# Altium project visor_cots.PrjPcb
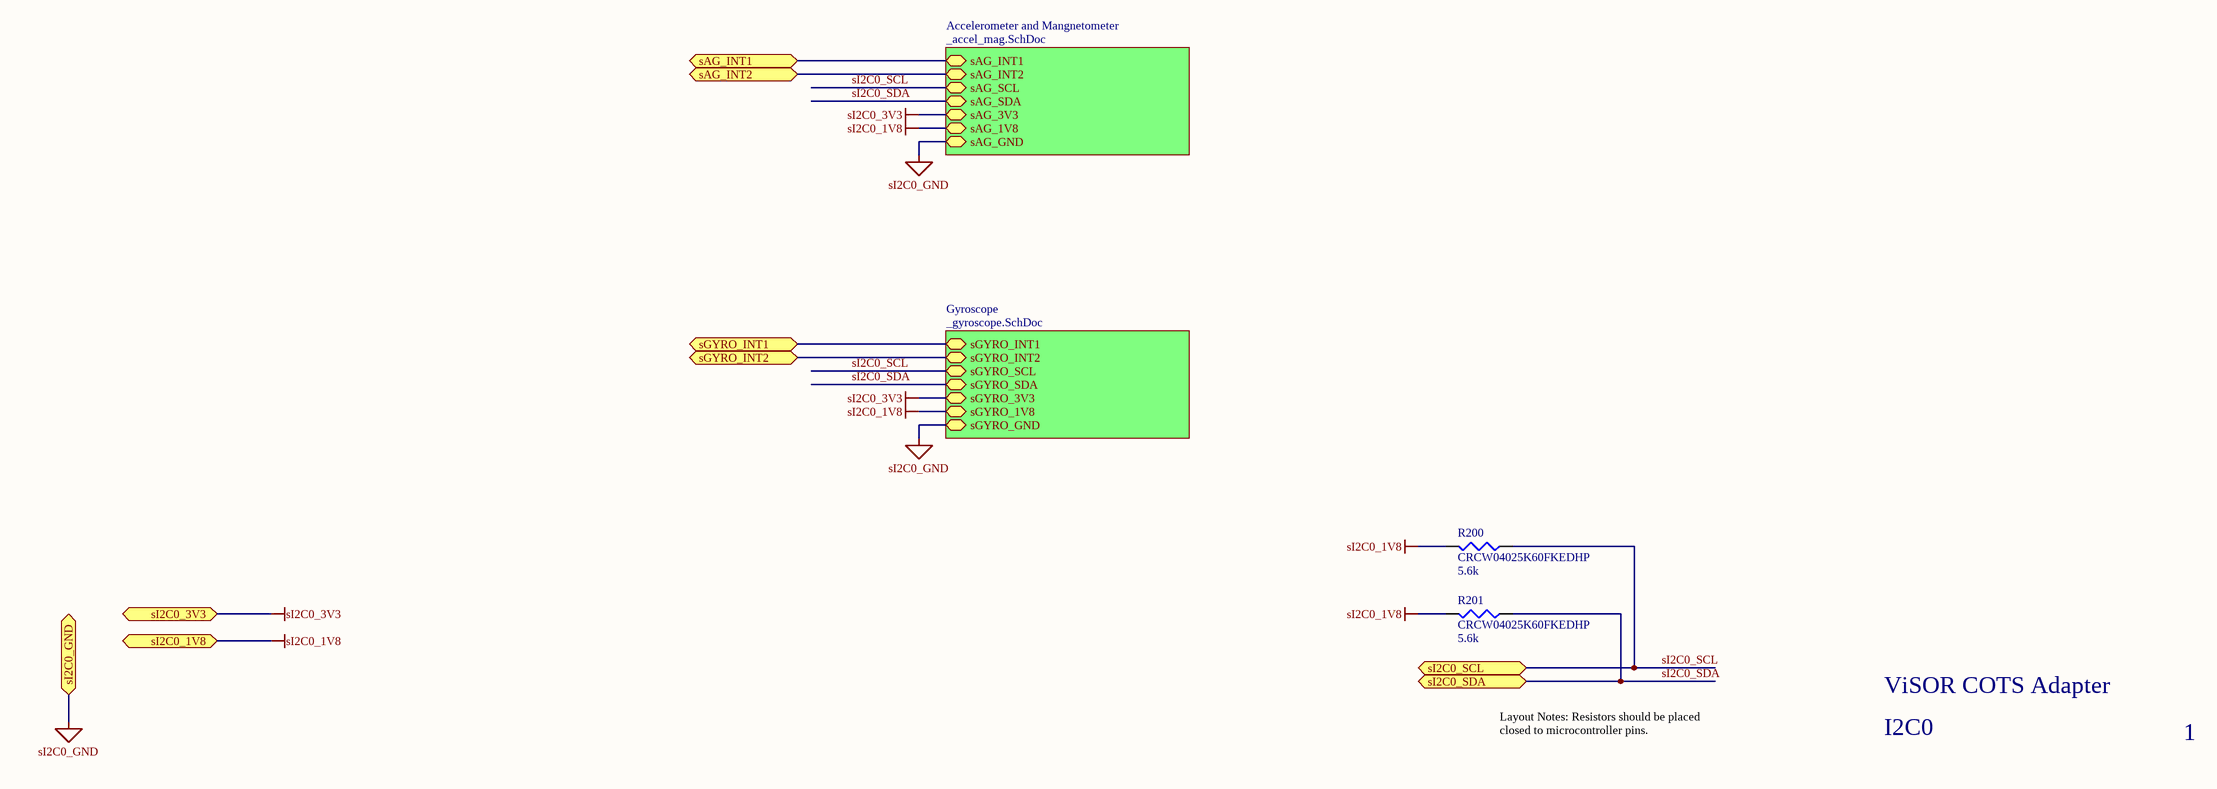
[diagram p0: _i2c0.SchDoc]
6 sheets, 116 parts. Net scope: strictly hierarchical (ports join the sheet entries above them; power ports are local).
Board file: 7798-20-0228.PcbDoc
Sheets:
  _i2c0.SchDoc
    Accelerometer and Mangnetometer = _accel_mag.SchDoc
    Gyroscope = _gyroscope.SchDoc
  TOP.SchDoc
    Dragonboard Connections = _power.SchDoc
    Dragonboard Connections = _io.SchDoc
    Accelerometer & Magnetometer = _accel_mag.SchDoc
    Gyroscope = _gyroscope.SchDoc

## Sheet _i2c0.SchDoc
size Tabloid

### Parts
R200  CRCW04025K60FKEDHP  value 5.6k  [0402]
R201  CRCW04025K60FKEDHP  value 5.6k  [0402]

### Sub-sheets
Accelerometer and Mangnetometer = _accel_mag.SchDoc: sAG_3V3, sAG_GND, sAG_SCL, sAG_SDA, sAG_INT1, sAG_INT2, sAG_1V8
Gyroscope = _gyroscope.SchDoc: sGYRO_3V3, sGYRO_GND, sGYRO_INT1, sGYRO_INT2, sGYRO_SCL, sGYRO_SDA, sGYRO_1V8

### Ports
sAG_INT1, sAG_INT2, sGYRO_INT1, sGYRO_INT2, sI2C0_1V8, sI2C0_3V3, sI2C0_GND, sI2C0_SCL, sI2C0_SDA

### Nets
sI2C0_1V8: R200.2 R201.2 ; port sI2C0_1V8, sheet Accelerometer and Mangnetometer/sAG_1V8, sheet Gyroscope/sGYRO_1V8  [project net sAG_1V8]
sI2C0_3V3: port sI2C0_3V3, sheet Accelerometer and Mangnetometer/sAG_3V3, sheet Gyroscope/sGYRO_3V3  [project net sAG_3V3]
sI2C0_GND: port sI2C0_GND, sheet Accelerometer and Mangnetometer/sAG_GND, sheet Gyroscope/sGYRO_GND  [project net sAG_GND]
sI2C0_SCL: R200.1 ; port sI2C0_SCL, sheet Accelerometer and Mangnetometer/sAG_SCL, sheet Gyroscope/sGYRO_SCL
sI2C0_SDA: R201.1 ; port sI2C0_SDA, sheet Accelerometer and Mangnetometer/sAG_SDA, sheet Gyroscope/sGYRO_SDA
NetR300_Accelerometer_and_Mangnetometer_2: port sAG_INT2, sheet Accelerometer and Mangnetometer/sAG_INT2
NetR301_Accelerometer_and_Mangnetometer_2: port sAG_INT1, sheet Accelerometer and Mangnetometer/sAG_INT1
NetU350_Gyroscope_2: port sGYRO_INT2, sheet Gyroscope/sGYRO_INT2
NetU350_Gyroscope_3: port sGYRO_INT1, sheet Gyroscope/sGYRO_INT1

### Notes on the sheet
- ViSOR COTS Adapter
- Layout Notes: Resistors should be placed closed to microcontroller pins.
- I2C0
- 1

### Library data of the parts
R200 R201 = CRCW0402xxxxFKED: 0.125W, -55-155C, 1005, 50V, ±1%

## Sheet _accel_mag.SchDoc
size Tabloid
Used 2 times, as channels Accelerometer and Mangnetometer, Accelerometer & Magnetometer. Parts and nets are listed once, with the designators drawn on the sheet.
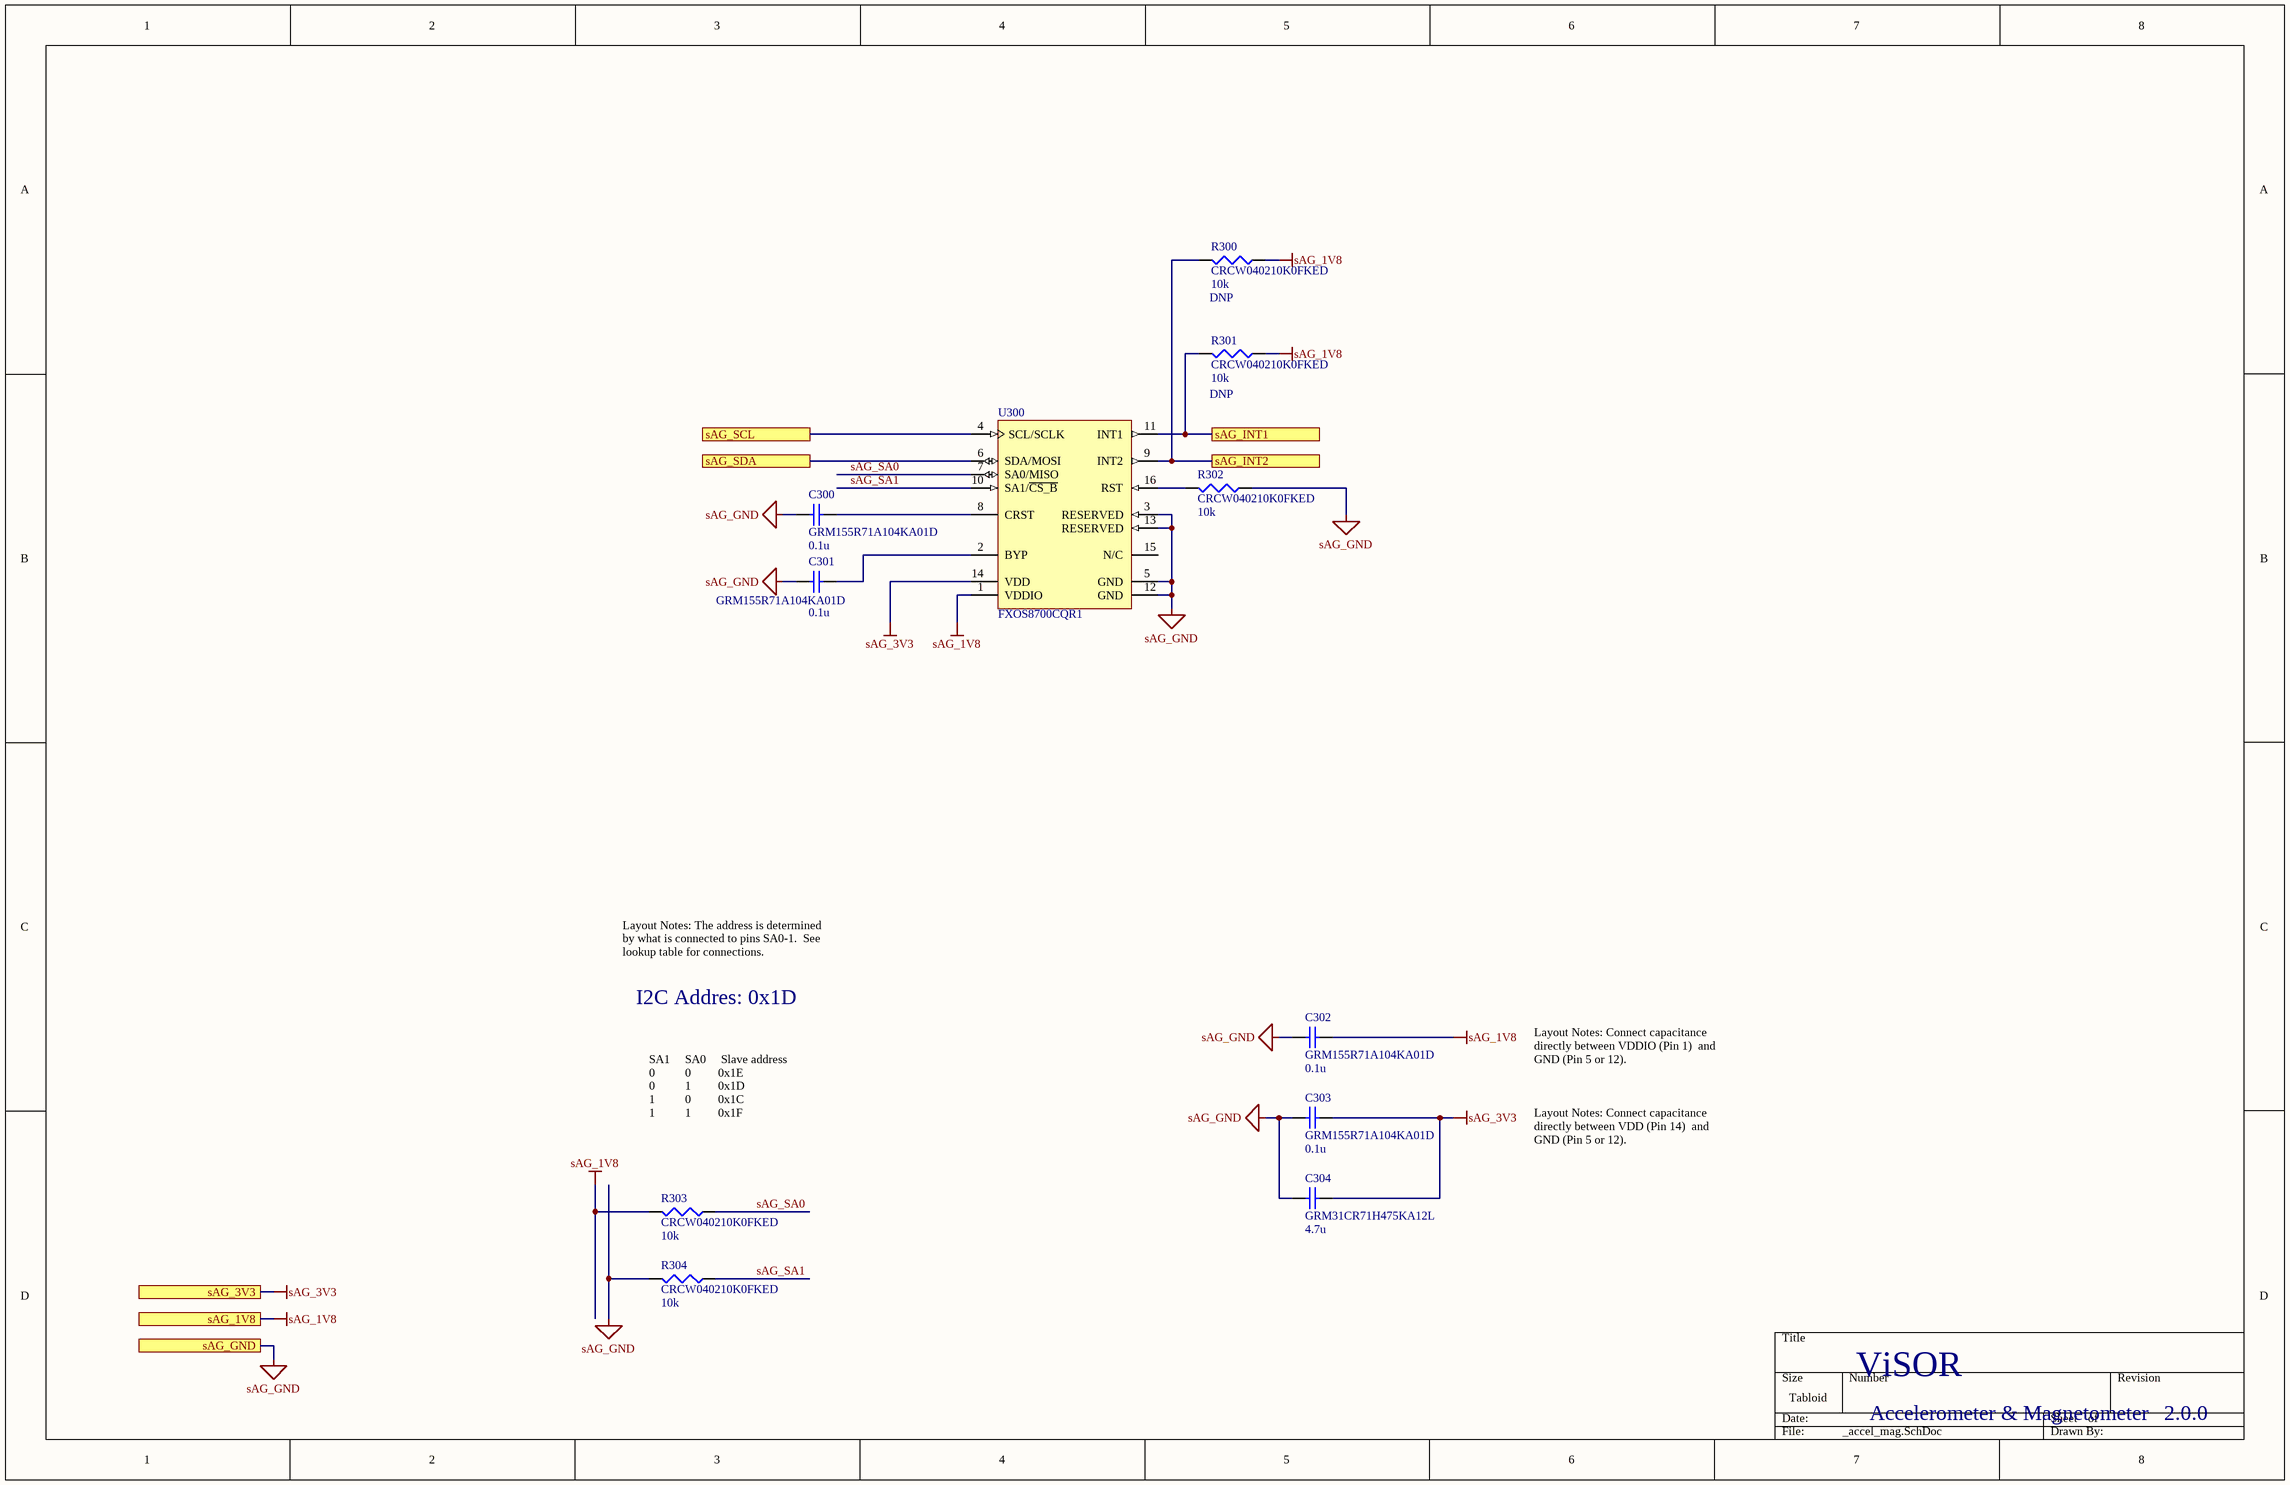
[diagram p1: _accel_mag.SchDoc]

### Parts
C300  GRM155R71A104KA01D  value 0.1u  [0402]
C301  GRM155R71A104KA01D  value 0.1u  [0402]
C302  GRM155R71A104KA01D  value 0.1u  [0402]
C303  GRM155R71A104KA01D  value 0.1u  [0402]
C304  GRM31CR71H475KA12L  value 4.7u  [1206]
R300  CRCW040210K0FKED  value 10k  [0402]
R301  CRCW040210K0FKED  value 10k  [0402]
R302  CRCW040210K0FKED  value 10k  [0402]
R303  CRCW040210K0FKED  value 10k  [0402]
R304  CRCW040210K0FKED  value 10k  [0402]
U300  FXOS8700CQR1  [FREE-QFN-16-3000X3000DE_V]

### Ports
sAG_1V8, sAG_3V3, sAG_GND, sAG_INT1, sAG_INT2, sAG_SCL, sAG_SDA

### Nets
sAG_1V8: C302.2 R300.1 R301.1 R303.2 U300.1(VDDIO) ; port sAG_1V8
sAG_3V3: C303.2 C304.2 U300.14(VDD) ; port sAG_3V3
sAG_GND: C300.2 C301.2 C302.1 C303.1 C304.1 R302.1 R304.2 U300.3(RESERVED) U300.5(GND) U300.12(GND) U300.13(RESERVED) ; port sAG_GND
sAG_INT1: R301.2 U300.11(INT1) ; port sAG_INT1
sAG_INT2: R300.2 U300.9(INT2) ; port sAG_INT2
sAG_SA0: R303.1 U300.7(SA0/MISO)
sAG_SA1: R304.1 U300.10(SA1/~{CS_B})
sAG_SCL: U300.4(SCL/SCLK) ; port sAG_SCL
sAG_SDA: U300.6(SDA/MOSI) ; port sAG_SDA
NetC300_1: C300.1 U300.8(CRST)
NetC301_1: C301.1 U300.2(BYP)
NetR302_2: R302.2 U300.16(RST)

Not connected (* = marked no-connect by the designer): U300 15(N/C)

### Channels
Accelerometer and Mangnetometer: designators end in _Accelerometer_and_Mangnetometer; ports sAG_1V8=sAG_1V8 sAG_3V3=sAG_3V3 sAG_GND=sAG_GND sAG_INT1=NetR301_Accelerometer_and_Mangnetometer_2 sAG_INT2=NetR300_Accelerometer_and_Mangnetometer_2 sAG_SCL=sI2C0_SCL sAG_SDA=sI2C0_SDA
Accelerometer & Magnetometer: ports sAG_1V8=sAG_1V8 sAG_3V3=sAG_3V3 sAG_GND=sAG_GND sAG_INT1=sGPIO_19/sAG_INT1 sAG_INT2=sGPIO_17/sAG_INT2 sAG_SCL=sI2C0_SCL sAG_SDA=sI2C0_SDA

### Notes on the sheet
- Layout Notes: The address is determined by what is connected to pins SA0-1.  See lookup table for connections.
- I2C Addres: 0x1D
- Layout Notes: Connect capacitance directly between VDDIO (Pin 1)  and GND (Pin 5 or 12).
- SA1     SA0     Slave address
  0          0         0x1E
  0          1         0x1D
  1          0         0x1C
  1          1         0x1F
- Layout Notes: Connect capacitance directly between VDD (Pin 14)  and GND (Pin 5 or 12).
- ViSOR
- Accelerometer & Magnetometer
- 2.0.0
- (in symbol CRCW0402xxxxFKED) DNP

### Library data of the parts
C300-C303 = GRM155R71AxxxKdddd: -55-125C, 1005, 10V, X7R, ±10%
C304 = GRM31CR71HxxxKdddd: -55-125C, 3216, 50V, X7R, ±10%
R300-R304 = CRCW0402xxxxFKED: 0.125W, -55-155C, 1005, 50V, ±1%
U300 = CMP-2000-05129-1: 6-Axis Xtrinsic Sensor with Integrated Linear Accelerometer and Magnetometer, 1.95 to 3.6 V, -40 to 85 degC, 16-Pin QFN, RoHS, Tape and Reel; Manufacturer: Freescale; Supply Voltage - Min: 1.95V; Operating Supply Voltage: 1.95Vto3.6V; Unit Weight: 0.000808oz; Supply Voltage - Max: 3.6V; Brand: FreescaleSemiconductor; Sensing Axis: X,Y,Z; Output Type: Digital; Package / Case: QFN-16; Datasheet Version: Rev. 1, 06/2012; Factory Pack Quantity: 1000; Mounting Style: SMD/SMT; Datasheet URL: https://datasheet.ciiva.com/12175/fxos8700cq-60595-12175213.pdf; Type: 6AxisSensor; Maximum Operating Temperature: +85C; Manufacturer URL: http://www.nxp.com/; Package Description: 16-Pin Quad Flat No-lead Package, Body 3 x 3 mm, Pitch 0.5 mm; RoHS: Details; Package Reference: QFN-16; Tradename: Xtrinsic; Packaging: Reel; Minimum Operating Temperature: -40C; Product Category: BoardMountAccelerationSensors

## Sheet _gyroscope.SchDoc
size Tabloid
Used 2 times, as channels Gyroscope, Gyroscope. Parts and nets are listed once, with the designators drawn on the sheet.
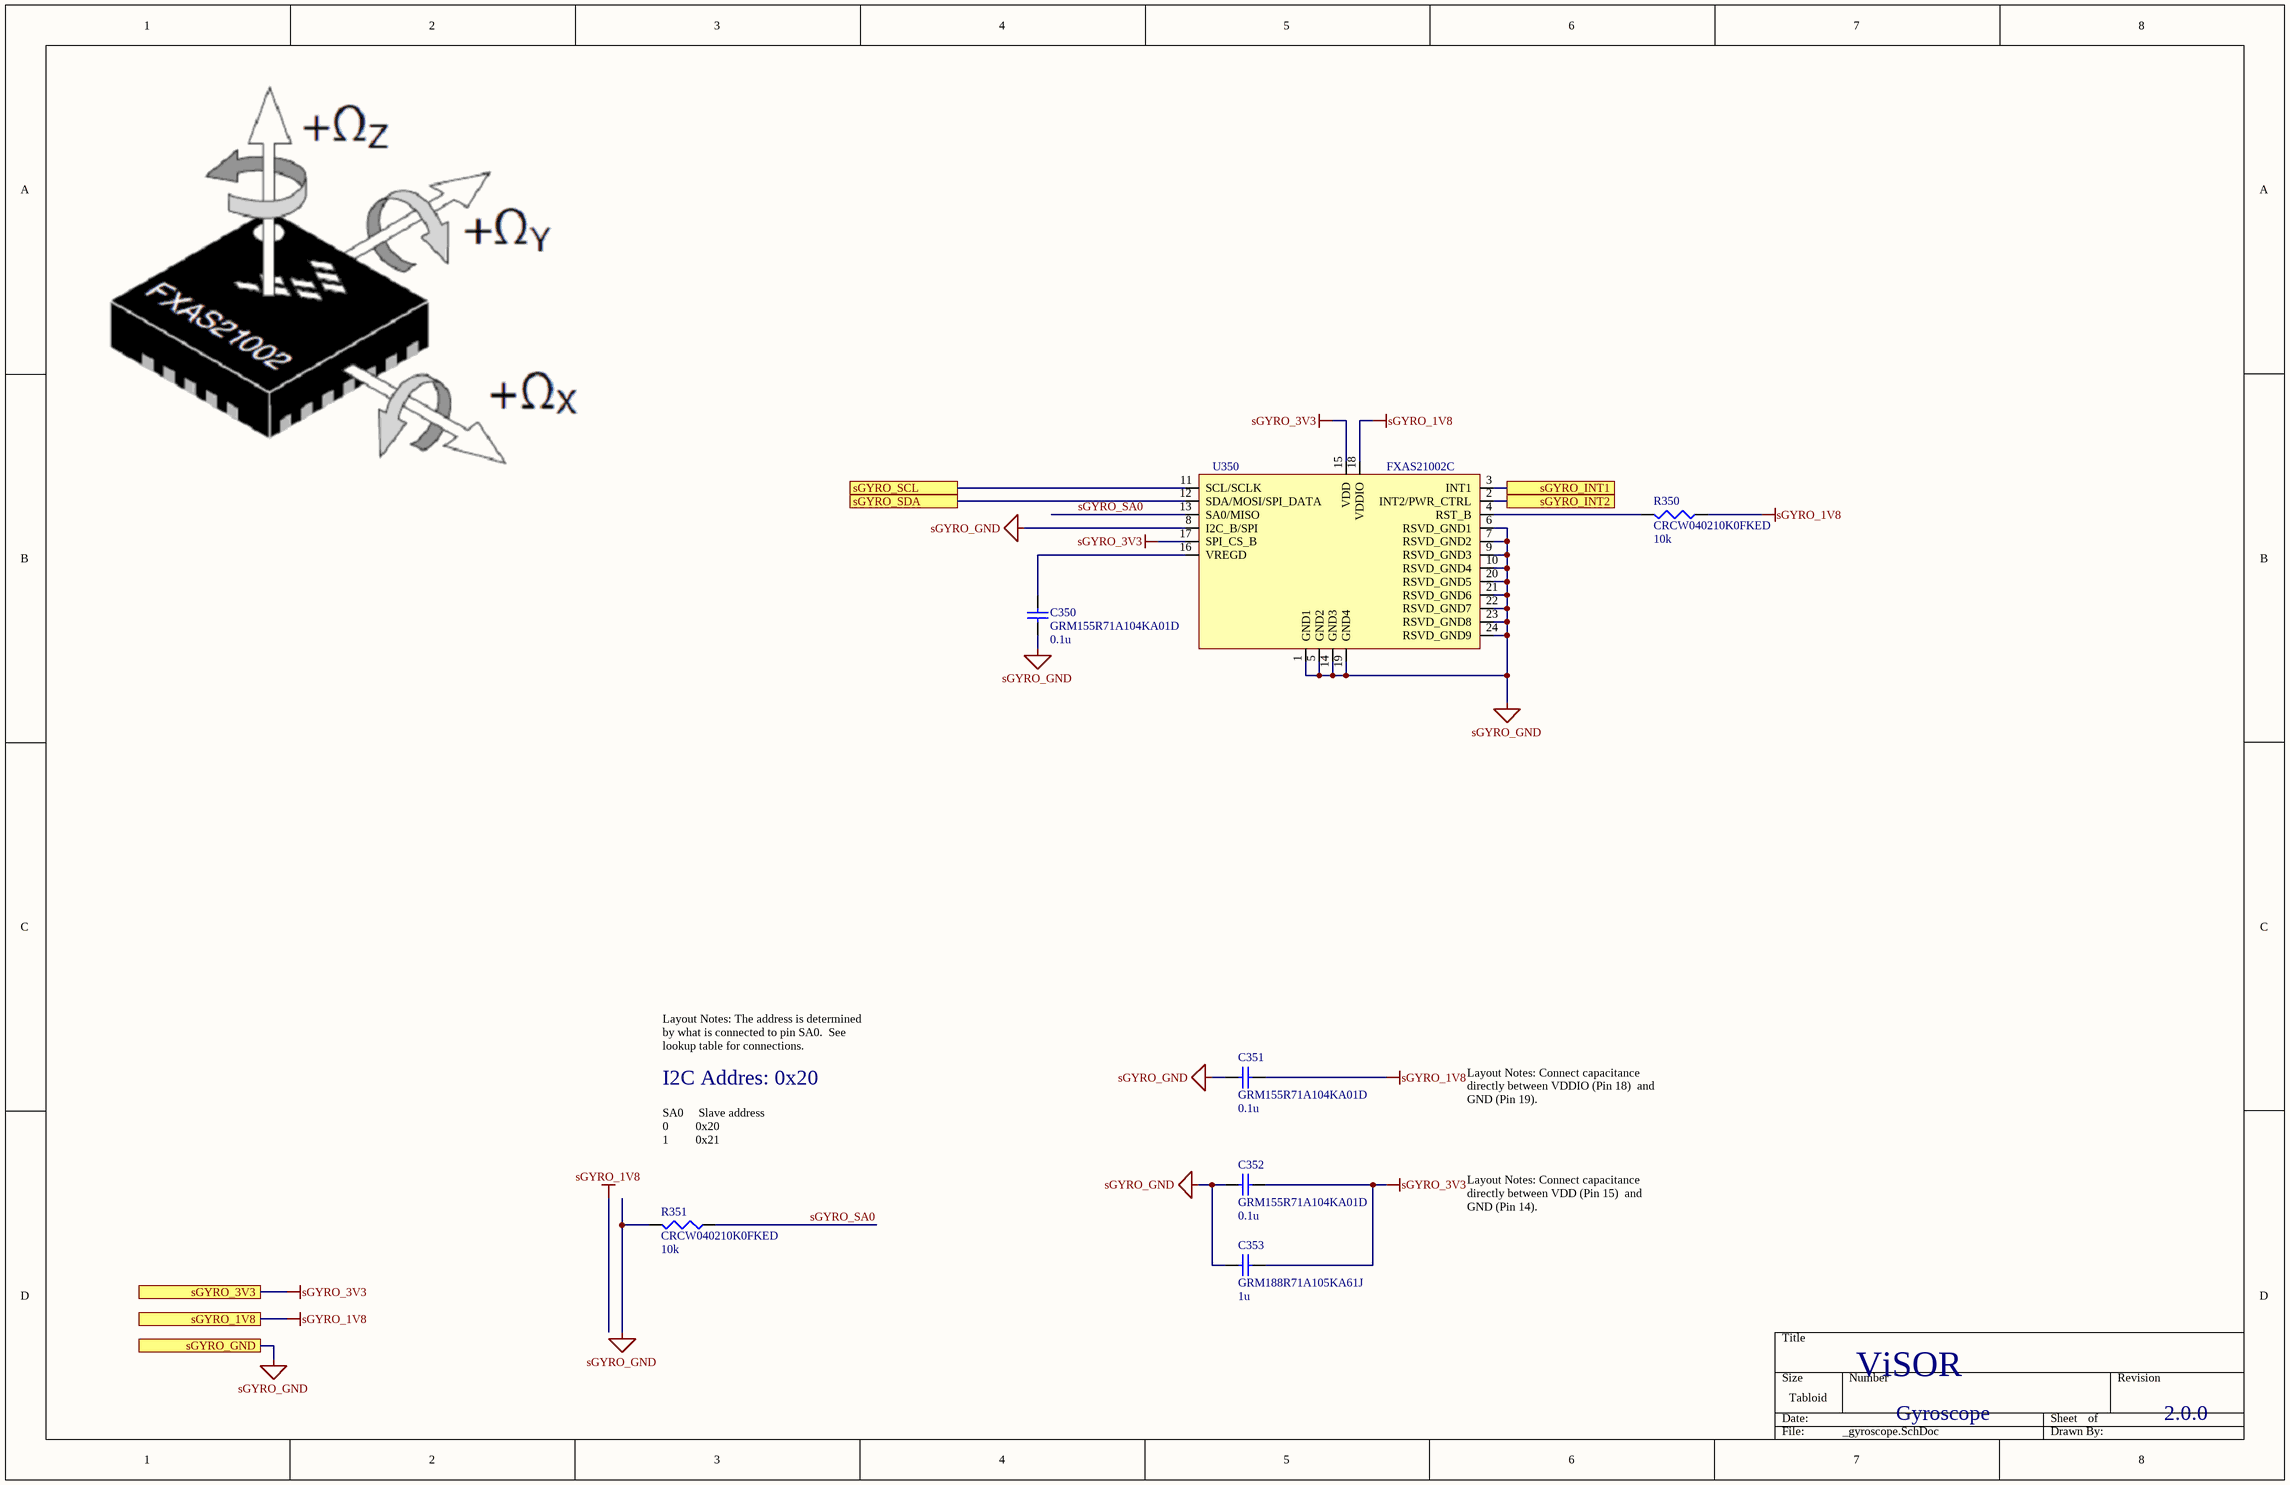
[diagram p2: _gyroscope.SchDoc]

### Parts
C350  GRM155R71A104KA01D  value 0.1u  [0402]
C351  GRM155R71A104KA01D  value 0.1u  [0402]
C352  GRM155R71A104KA01D  value 0.1u  [0402]
C353  GRM188R71A105KA61J  value 1u  [0603]
R350  CRCW040210K0FKED  value 10k  [0402]
R351  CRCW040210K0FKED  value 10k  [0402]
U350  FXAS21002C  [SMD QFN 24_4X4MM 7/5]

### Ports
sGYRO_1V8, sGYRO_3V3, sGYRO_GND, sGYRO_INT1, sGYRO_INT2, sGYRO_SCL, sGYRO_SDA

### Nets
sGYRO_1V8: C351.2 R350.1 U350.18(VDDIO) ; port sGYRO_1V8
sGYRO_3V3: C352.2 C353.1 U350.15(VDD) U350.17(SPI_CS_B) ; port sGYRO_3V3
sGYRO_GND: C350.2 C351.1 C352.1 C353.2 R351.2 U350.1(GND1) U350.5(GND2) U350.6(RSVD_GND1) U350.7(RSVD_GND2) U350.8(I2C_B/SPI) U350.9(RSVD_GND3) U350.10(RSVD_GND4) U350.14(GND3) U350.19(GND4) U350.20(RSVD_GND5) U350.21(RSVD_GND6) U350.22(RSVD_GND7) U350.23(RSVD_GND8) U350.24(RSVD_GND9) ; port sGYRO_GND
sGYRO_INT1: U350.3(INT1) ; port sGYRO_INT1
sGYRO_INT2: U350.2(INT2/PWR_CTRL) ; port sGYRO_INT2
sGYRO_SA0: R351.1 U350.13(SA0/MISO)
sGYRO_SCL: U350.11(SCL/SCLK) ; port sGYRO_SCL
sGYRO_SDA: U350.12(SDA/MOSI/SPI_DATA) ; port sGYRO_SDA
NetC350_1: C350.1 U350.16(VREGD)
NetR350_2: R350.2 U350.4(RST_B)

### Channels
Gyroscope: designators end in _Gyroscope; ports sGYRO_1V8=sAG_1V8 sGYRO_3V3=sAG_3V3 sGYRO_GND=sAG_GND sGYRO_INT1=NetU350_Gyroscope_3 sGYRO_INT2=NetU350_Gyroscope_2 sGYRO_SCL=sI2C0_SCL sGYRO_SDA=sI2C0_SDA
Gyroscope: ports sGYRO_1V8=sAG_1V8 sGYRO_3V3=sAG_3V3 sGYRO_GND=sAG_GND sGYRO_INT1=sGPIO_18/sGYRO_INT1 sGYRO_INT2=sGPIO_16/sGYRO_INT2 sGYRO_SCL=sI2C0_SCL sGYRO_SDA=sI2C0_SDA

### Notes on the sheet
- I2C Addres: 0x20
- Layout Notes: The address is determined by what is connected to pin SA0.  See lookup table for connections.
- Layout Notes: Connect capacitance directly between VDDIO (Pin 18)  and GND (Pin 19).
- SA0     Slave address
  0         0x20
  1         0x21
- Layout Notes: Connect capacitance directly between VDD (Pin 15)  and GND (Pin 14).
- ViSOR
- Gyroscope
- 2.0.0

### Library data of the parts
C350-C352 = GRM155R71AxxxKdddd: -55-125C, 1005, 10V, X7R, ±10%
C353 = GRM188R71AxxxKdddd: -55-125C, 1608, 10V, X7R, ±10%
R350 R351 = CRCW0402xxxxFKED: 0.125W, -55-155C, 1005, 50V, ±1%
U350 = FXAS21002C: 3-Axis Digital Angular Rate  Gyroscope

## Sheet TOP.SchDoc
size Tabloid
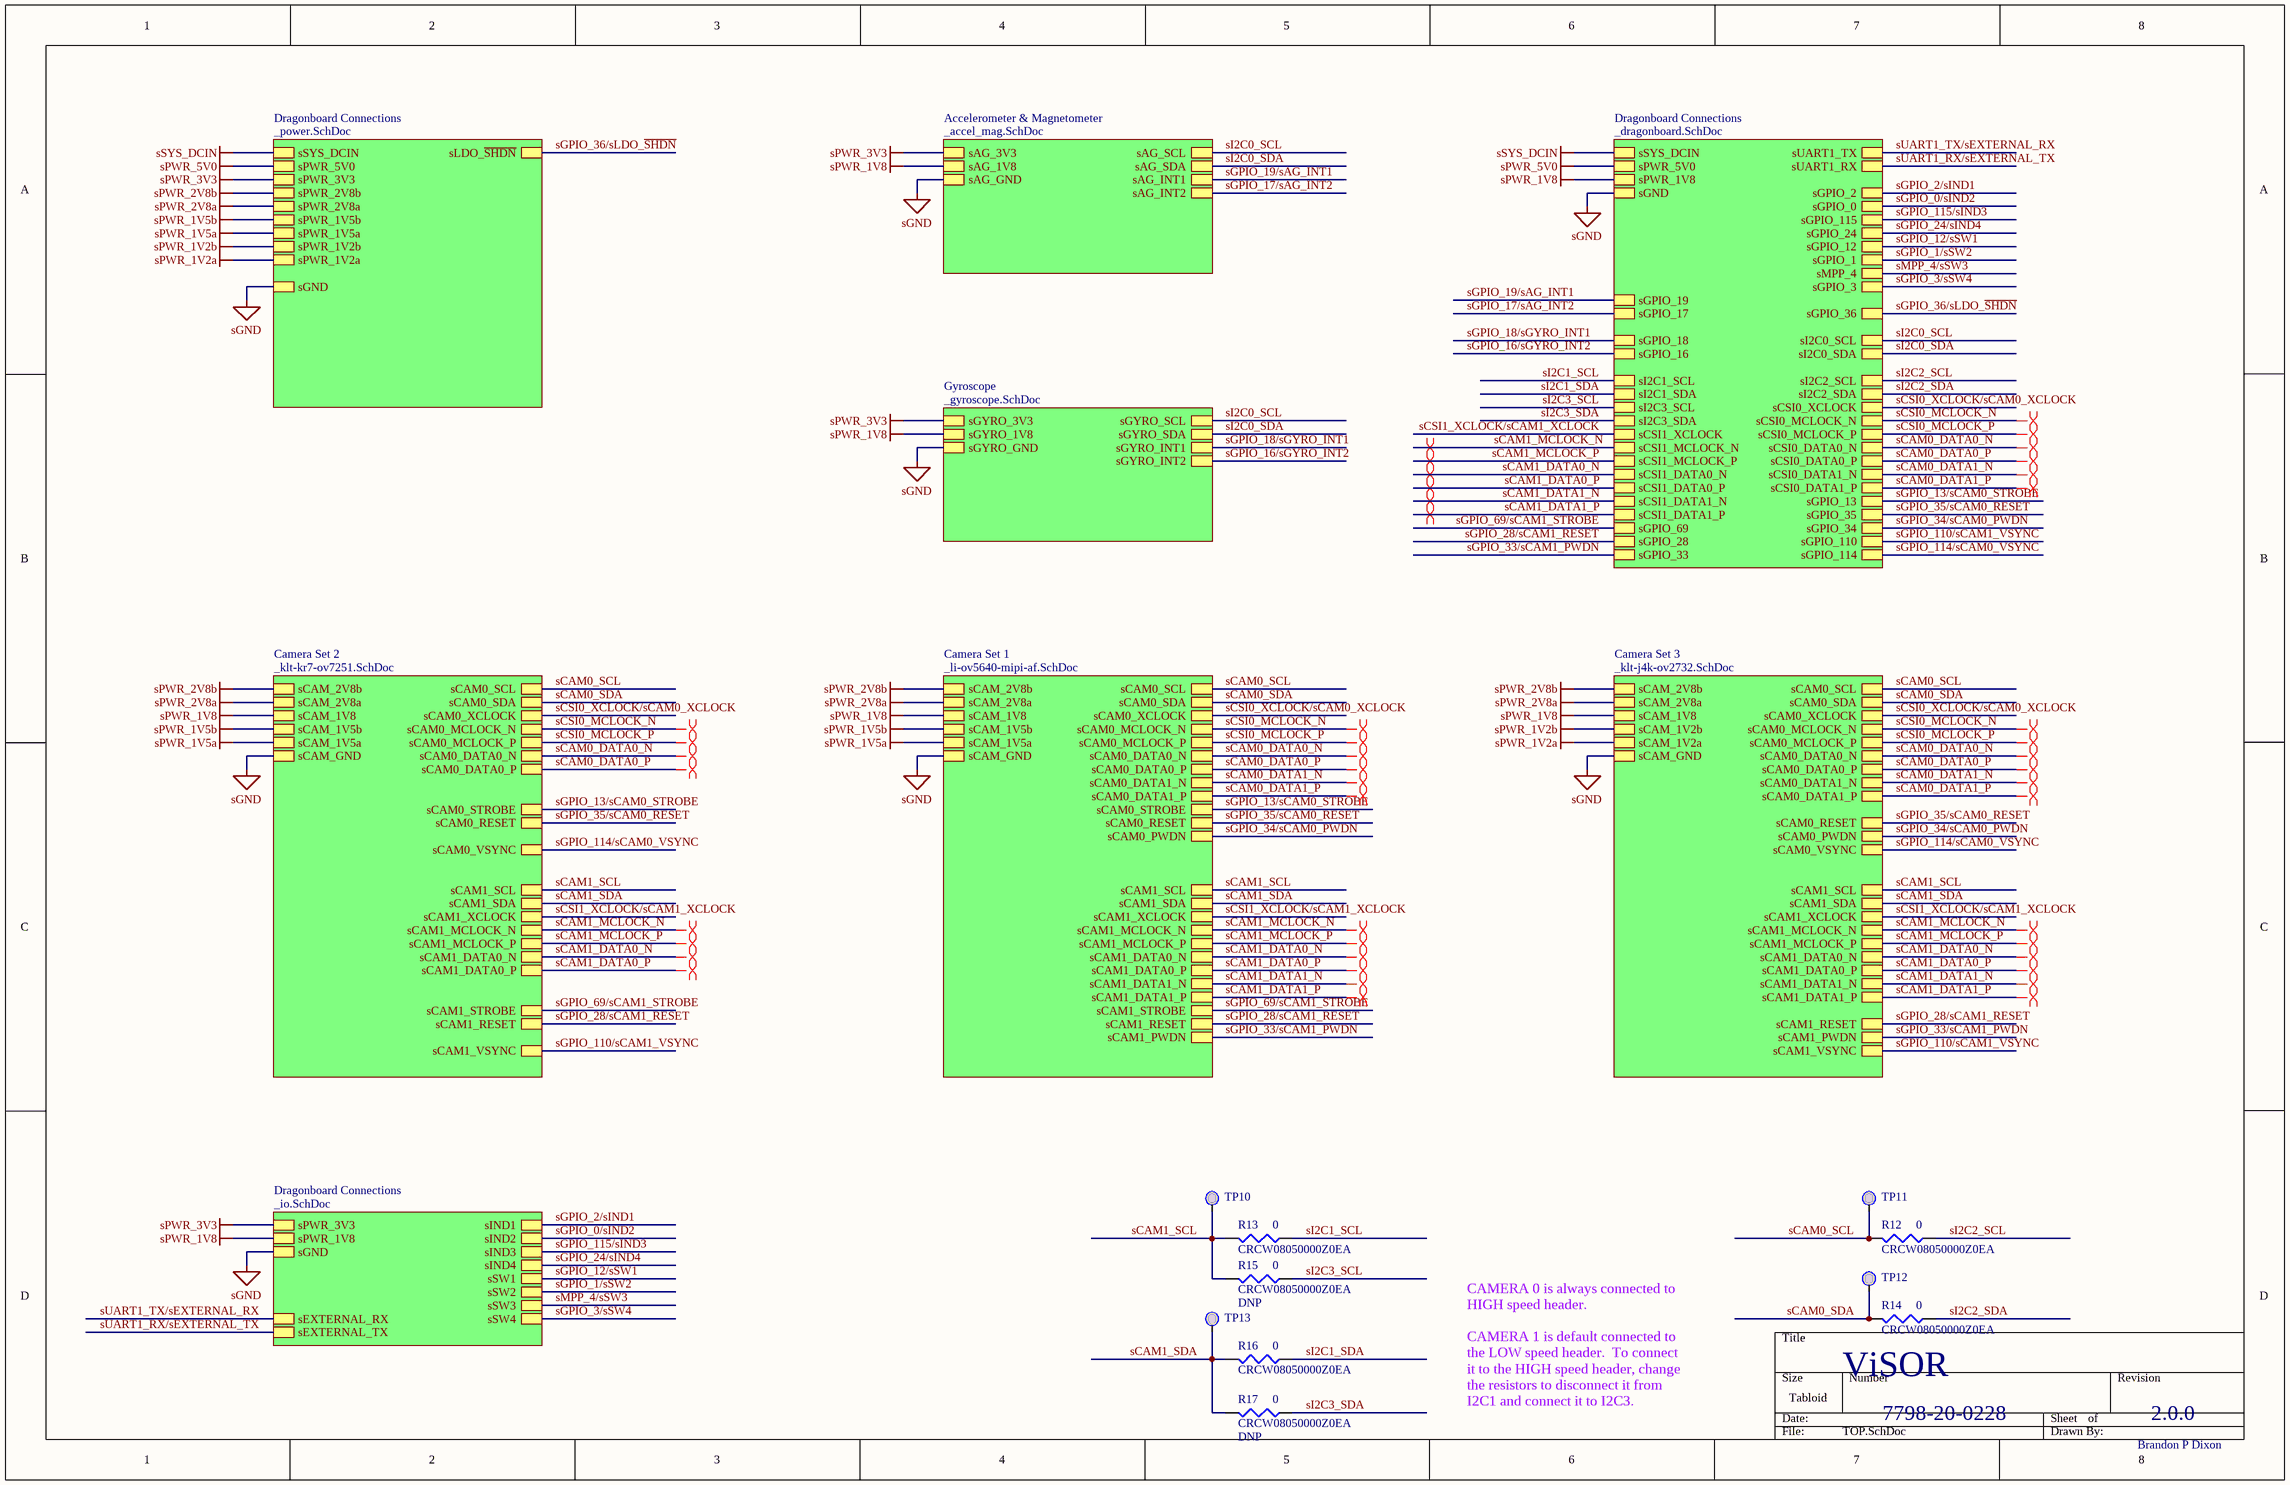
[diagram p3: TOP.SchDoc]

### Parts
R12  CRCW08050000Z0EA  value 0  [6-0805_M]
R13  CRCW08050000Z0EA  value 0  [6-0805_M]
R14  CRCW08050000Z0EA  value 0  [6-0805_M]
R15  CRCW08050000Z0EA  value 0  [6-0805_M]
R16  CRCW08050000Z0EA  value 0  [6-0805_M]
R17  CRCW08050000Z0EA  value 0  [6-0805_M]
TP10  TP  [TP_TH]  (value not drawn)
TP11  TP  [TP_TH]  (value not drawn)
TP12  TP  [TP_TH]  (value not drawn)
TP13  TP  [TP_TH]  (value not drawn)

### Sub-sheets
Accelerometer & Magnetometer = _accel_mag.SchDoc: sAG_GND, sAG_3V3, sAG_1V8, sAG_SCL, sAG_SDA, sAG_INT1, sAG_INT2
Camera Set 1 = _li-ov5640-mipi-af.SchDoc (file not in this document): sCAM_GND, sCAM_1V8, sCAM_1V5a, sCAM_1V5b, sCAM_2V8a, sCAM_2V8b, sCAM0_SCL, sCAM0_SDA, sCAM0_DATA0_N, sCAM0_DATA0_P, sCAM0_DATA1_N, sCAM0_DATA1_P, sCAM0_MCLOCK_N, sCAM0_MCLOCK_P, sCAM0_XCLOCK, sCAM0_STROBE, sCAM0_RESET, sCAM0_PWDN, sCAM1_SCL, sCAM1_SDA, sCAM1_DATA0_N, sCAM1_DATA0_P, sCAM1_DATA1_N, sCAM1_DATA1_P, sCAM1_MCLOCK_N, sCAM1_MCLOCK_P, sCAM1_XCLOCK, sCAM1_STROBE, sCAM1_RESET, sCAM1_PWDN
Camera Set 2 = _klt-kr7-ov7251.SchDoc (file not in this document): sCAM_GND, sCAM_1V8, sCAM_1V5a, sCAM_1V5b, sCAM_2V8a, sCAM_2V8b, sCAM0_SCL, sCAM0_SDA, sCAM0_DATA0_N, sCAM0_DATA0_P, sCAM0_MCLOCK_N, sCAM0_MCLOCK_P, sCAM0_XCLOCK, sCAM1_MCLOCK_N, sCAM1_MCLOCK_P, sCAM0_STROBE, sCAM0_RESET, sCAM0_VSYNC, sCAM1_STROBE, sCAM1_RESET, sCAM1_VSYNC, sCAM1_DATA0_N, sCAM1_DATA0_P, sCAM1_SCL, sCAM1_SDA, sCAM1_XCLOCK
Camera Set 3 = _klt-j4k-ov2732.SchDoc (file not in this document): sCAM_GND, sCAM_1V8, sCAM_1V2a, sCAM_1V2b, sCAM_2V8a, sCAM_2V8b, sCAM0_SCL, sCAM0_SDA, sCAM0_DATA0_N, sCAM0_DATA0_P, sCAM0_MCLOCK_N, sCAM0_MCLOCK_P, sCAM0_XCLOCK, sCAM0_RESET, sCAM0_VSYNC, sCAM1_VSYNC, sCAM0_DATA1_N, sCAM0_DATA1_P, sCAM1_SCL, sCAM1_SDA, sCAM1_DATA0_N, sCAM1_DATA0_P, sCAM1_MCLOCK_N, sCAM1_MCLOCK_P, sCAM1_XCLOCK, sCAM1_RESET, sCAM1_DATA1_N, sCAM1_DATA1_P, sCAM0_PWDN, sCAM1_PWDN
Dragonboard Connections = _dragonboard.SchDoc (file not in this document): sSYS_DCIN, sPWR_5V0, sPWR_1V8, sGND, sUART1_TX, sUART1_RX, sGPIO_115, sGPIO_24, sGPIO_12, sMPP_4, sI2C0_SCL, sI2C0_SDA, sGPIO_19, sGPIO_17, sGPIO_18, sGPIO_16, sGPIO_3, sGPIO_1, sGPIO_0, sGPIO_2, sGPIO_36, sI2C1_SCL, sI2C1_SDA, sI2C3_SCL, sI2C3_SDA, sCSI1_DATA0_N, sCSI1_DATA0_P, sCSI1_DATA1_N, sCSI1_DATA1_P, sCSI1_XCLOCK, sCSI1_MCLOCK_N, sCSI1_MCLOCK_P, sGPIO_69, sGPIO_28, sGPIO_33, sI2C2_SCL, sI2C2_SDA, sCSI0_DATA0_N, sCSI0_DATA0_P, sCSI0_DATA1_N, sCSI0_DATA1_P, sCSI0_MCLOCK_N, sCSI0_MCLOCK_P, sCSI0_XCLOCK, sGPIO_13, sGPIO_34, sGPIO_35, sGPIO_114, sGPIO_110
Dragonboard Connections = _power.SchDoc: sSYS_DCIN, sPWR_5V0, sGND, sLDO_~{SHDN}, sPWR_3V3, sPWR_1V5a, sPWR_1V5b, sPWR_2V8a, sPWR_2V8b, sPWR_1V2a, sPWR_1V2b
Dragonboard Connections = _io.SchDoc: sGND, sPWR_3V3, sIND1, sIND2, sIND3, sPWR_1V8, sIND4, sSW1, sSW2, sSW3, sSW4, sEXTERNAL_RX, sEXTERNAL_TX
Gyroscope = _gyroscope.SchDoc: sGYRO_GND, sGYRO_3V3, sGYRO_1V8, sGYRO_SCL, sGYRO_SDA, sGYRO_INT1, sGYRO_INT2

### Nets
sGND: sheet Dragonboard Connections/sGND, sheet Dragonboard Connections/sGND, sheet Dragonboard Connections/sGND, sheet Accelerometer & Magnetometer/sAG_GND, sheet Gyroscope/sGYRO_GND, sheet Camera Set 1/sCAM_GND, sheet Camera Set 2/sCAM_GND, sheet Camera Set 3/sCAM_GND  [project net sAG_GND]
sPWR_1V2a: sheet Dragonboard Connections/sPWR_1V2a, sheet Camera Set 3/sCAM_1V2a
sPWR_1V2b: sheet Dragonboard Connections/sPWR_1V2b, sheet Camera Set 3/sCAM_1V2b
sPWR_1V5a: sheet Dragonboard Connections/sPWR_1V5a, sheet Camera Set 1/sCAM_1V5a, sheet Camera Set 2/sCAM_1V5a
sPWR_1V5b: sheet Dragonboard Connections/sPWR_1V5b, sheet Camera Set 1/sCAM_1V5b, sheet Camera Set 2/sCAM_1V5b
sPWR_1V8: sheet Dragonboard Connections/sPWR_1V8, sheet Dragonboard Connections/sPWR_1V8, sheet Accelerometer & Magnetometer/sAG_1V8, sheet Gyroscope/sGYRO_1V8, sheet Camera Set 1/sCAM_1V8, sheet Camera Set 2/sCAM_1V8, sheet Camera Set 3/sCAM_1V8  [project net sAG_1V8]
sPWR_2V8a: sheet Dragonboard Connections/sPWR_2V8a, sheet Camera Set 1/sCAM_2V8a, sheet Camera Set 2/sCAM_2V8a, sheet Camera Set 3/sCAM_2V8a
sPWR_2V8b: sheet Dragonboard Connections/sPWR_2V8b, sheet Camera Set 1/sCAM_2V8b, sheet Camera Set 2/sCAM_2V8b, sheet Camera Set 3/sCAM_2V8b
sPWR_3V3: sheet Dragonboard Connections/sPWR_3V3, sheet Dragonboard Connections/sPWR_3V3, sheet Accelerometer & Magnetometer/sAG_3V3, sheet Gyroscope/sGYRO_3V3  [project net sAG_3V3]
sPWR_5V0: sheet Dragonboard Connections/sPWR_5V0, sheet Dragonboard Connections/sPWR_5V0
sSYS_DCIN: sheet Dragonboard Connections/sSYS_DCIN, sheet Dragonboard Connections/sSYS_DCIN
sCAM0_DATA0_N: sheet Dragonboard Connections/sCSI0_DATA0_N, sheet Camera Set 1/sCAM0_DATA0_N, sheet Camera Set 2/sCAM0_DATA0_N, sheet Camera Set 3/sCAM0_DATA0_N
sCAM0_DATA0_P: sheet Dragonboard Connections/sCSI0_DATA0_P, sheet Camera Set 1/sCAM0_DATA0_P, sheet Camera Set 2/sCAM0_DATA0_P, sheet Camera Set 3/sCAM0_DATA0_P
sCAM0_DATA1_N: sheet Dragonboard Connections/sCSI0_DATA1_N, sheet Camera Set 1/sCAM0_DATA1_N, sheet Camera Set 3/sCAM0_DATA1_N
sCAM0_DATA1_P: sheet Dragonboard Connections/sCSI0_DATA1_P, sheet Camera Set 1/sCAM0_DATA1_P, sheet Camera Set 3/sCAM0_DATA1_P
sCAM0_SCL: R12.2 TP11.1 ; sheet Camera Set 1/sCAM0_SCL, sheet Camera Set 2/sCAM0_SCL, sheet Camera Set 3/sCAM0_SCL
sCAM0_SDA: R14.2 TP12.1 ; sheet Camera Set 1/sCAM0_SDA, sheet Camera Set 2/sCAM0_SDA, sheet Camera Set 3/sCAM0_SDA
sCAM1_DATA0_N: sheet Dragonboard Connections/sCSI1_DATA0_N, sheet Camera Set 1/sCAM1_DATA0_N, sheet Camera Set 2/sCAM1_DATA0_N, sheet Camera Set 3/sCAM1_DATA0_N
sCAM1_DATA0_P: sheet Dragonboard Connections/sCSI1_DATA0_P, sheet Camera Set 1/sCAM1_DATA0_P, sheet Camera Set 2/sCAM1_DATA0_P, sheet Camera Set 3/sCAM1_DATA0_P
sCAM1_DATA1_N: sheet Dragonboard Connections/sCSI1_DATA1_N, sheet Camera Set 1/sCAM1_DATA1_N, sheet Camera Set 3/sCAM1_DATA1_N
sCAM1_DATA1_P: sheet Dragonboard Connections/sCSI1_DATA1_P, sheet Camera Set 1/sCAM1_DATA1_P, sheet Camera Set 3/sCAM1_DATA1_P
sCAM1_MCLOCK_N: sheet Dragonboard Connections/sCSI1_MCLOCK_N, sheet Camera Set 1/sCAM1_MCLOCK_N, sheet Camera Set 2/sCAM1_MCLOCK_N, sheet Camera Set 3/sCAM1_MCLOCK_N
sCAM1_MCLOCK_P: sheet Dragonboard Connections/sCSI1_MCLOCK_P, sheet Camera Set 1/sCAM1_MCLOCK_P, sheet Camera Set 2/sCAM1_MCLOCK_P, sheet Camera Set 3/sCAM1_MCLOCK_P
sCAM1_SCL: R13.2 R15.2 TP10.1 ; sheet Camera Set 1/sCAM1_SCL, sheet Camera Set 2/sCAM1_SCL, sheet Camera Set 3/sCAM1_SCL
sCAM1_SDA: R16.2 R17.2 TP13.1 ; sheet Camera Set 1/sCAM1_SDA, sheet Camera Set 2/sCAM1_SDA, sheet Camera Set 3/sCAM1_SDA
sCSI0_MCLOCK_N: sheet Dragonboard Connections/sCSI0_MCLOCK_N, sheet Camera Set 1/sCAM0_MCLOCK_N, sheet Camera Set 2/sCAM0_MCLOCK_N, sheet Camera Set 3/sCAM0_MCLOCK_N
sCSI0_MCLOCK_P: sheet Dragonboard Connections/sCSI0_MCLOCK_P, sheet Camera Set 1/sCAM0_MCLOCK_P, sheet Camera Set 2/sCAM0_MCLOCK_P, sheet Camera Set 3/sCAM0_MCLOCK_P
sCSI0_XCLOCK/sCAM0_XCLOCK: sheet Dragonboard Connections/sCSI0_XCLOCK, sheet Camera Set 1/sCAM0_XCLOCK, sheet Camera Set 2/sCAM0_XCLOCK, sheet Camera Set 3/sCAM0_XCLOCK
sCSI1_XCLOCK/sCAM1_XCLOCK: sheet Dragonboard Connections/sCSI1_XCLOCK, sheet Camera Set 1/sCAM1_XCLOCK, sheet Camera Set 2/sCAM1_XCLOCK, sheet Camera Set 3/sCAM1_XCLOCK
sGPIO_0/sIND2: sheet Dragonboard Connections/sGPIO_0, sheet Dragonboard Connections/sIND2
sGPIO_1/sSW2: sheet Dragonboard Connections/sGPIO_1, sheet Dragonboard Connections/sSW2
sGPIO_2/sIND1: sheet Dragonboard Connections/sGPIO_2, sheet Dragonboard Connections/sIND1
sGPIO_3/sSW4: sheet Dragonboard Connections/sGPIO_3, sheet Dragonboard Connections/sSW4
sGPIO_12/sSW1: sheet Dragonboard Connections/sGPIO_12, sheet Dragonboard Connections/sSW1
sGPIO_13/sCAM0_STROBE: sheet Dragonboard Connections/sGPIO_13, sheet Camera Set 1/sCAM0_STROBE, sheet Camera Set 2/sCAM0_STROBE
sGPIO_16/sGYRO_INT2: sheet Dragonboard Connections/sGPIO_16, sheet Gyroscope/sGYRO_INT2
sGPIO_17/sAG_INT2: sheet Dragonboard Connections/sGPIO_17, sheet Accelerometer & Magnetometer/sAG_INT2
sGPIO_18/sGYRO_INT1: sheet Dragonboard Connections/sGPIO_18, sheet Gyroscope/sGYRO_INT1
sGPIO_19/sAG_INT1: sheet Dragonboard Connections/sGPIO_19, sheet Accelerometer & Magnetometer/sAG_INT1
sGPIO_24/sIND4: sheet Dragonboard Connections/sGPIO_24, sheet Dragonboard Connections/sIND4
sGPIO_28/sCAM1_RESET: sheet Dragonboard Connections/sGPIO_28, sheet Camera Set 1/sCAM1_RESET, sheet Camera Set 2/sCAM1_RESET, sheet Camera Set 3/sCAM1_RESET
sGPIO_33/sCAM1_PWDN: sheet Dragonboard Connections/sGPIO_33, sheet Camera Set 1/sCAM1_PWDN, sheet Camera Set 3/sCAM1_PWDN
sGPIO_34/sCAM0_PWDN: sheet Dragonboard Connections/sGPIO_34, sheet Camera Set 1/sCAM0_PWDN, sheet Camera Set 3/sCAM0_PWDN
sGPIO_35/sCAM0_RESET: sheet Dragonboard Connections/sGPIO_35, sheet Camera Set 1/sCAM0_RESET, sheet Camera Set 2/sCAM0_RESET, sheet Camera Set 3/sCAM0_RESET
sGPIO_36/sLDO_~{SHDN}: sheet Dragonboard Connections/sGPIO_36, sheet Dragonboard Connections/sLDO_~{SHDN}
sGPIO_69/sCAM1_STROBE: sheet Dragonboard Connections/sGPIO_69, sheet Camera Set 1/sCAM1_STROBE, sheet Camera Set 2/sCAM1_STROBE
sGPIO_110/sCAM1_VSYNC: sheet Dragonboard Connections/sGPIO_110, sheet Camera Set 2/sCAM1_VSYNC, sheet Camera Set 3/sCAM1_VSYNC
sGPIO_114/sCAM0_VSYNC: sheet Dragonboard Connections/sGPIO_114, sheet Camera Set 2/sCAM0_VSYNC, sheet Camera Set 3/sCAM0_VSYNC
sGPIO_115/sIND3: sheet Dragonboard Connections/sGPIO_115, sheet Dragonboard Connections/sIND3
sI2C0_SCL: sheet Dragonboard Connections/sI2C0_SCL, sheet Accelerometer & Magnetometer/sAG_SCL, sheet Gyroscope/sGYRO_SCL
sI2C0_SDA: sheet Dragonboard Connections/sI2C0_SDA, sheet Accelerometer & Magnetometer/sAG_SDA, sheet Gyroscope/sGYRO_SDA
sI2C1_SCL: R13.1 ; sheet Dragonboard Connections/sI2C1_SCL
sI2C1_SDA: R16.1 ; sheet Dragonboard Connections/sI2C1_SDA
sI2C2_SCL: R12.1 ; sheet Dragonboard Connections/sI2C2_SCL
sI2C2_SDA: R14.1 ; sheet Dragonboard Connections/sI2C2_SDA
sI2C3_SCL: R15.1 ; sheet Dragonboard Connections/sI2C3_SCL
sI2C3_SDA: R17.1 ; sheet Dragonboard Connections/sI2C3_SDA
sMPP_4/sSW3: sheet Dragonboard Connections/sMPP_4, sheet Dragonboard Connections/sSW3
sUART1_RX/sEXTERNAL_TX: sheet Dragonboard Connections/sUART1_RX, sheet Dragonboard Connections/sEXTERNAL_TX
sUART1_TX/sEXTERNAL_RX: sheet Dragonboard Connections/sUART1_TX, sheet Dragonboard Connections/sEXTERNAL_RX

### Layout directives
differential pair: sCAM0_DATA0_N, sCAM0_DATA0_P, sCAM0_DATA1_N, sCAM0_DATA1_P, sCAM1_DATA0_N, sCAM1_DATA0_P, sCAM1_DATA1_N, sCAM1_DATA1_P, sCAM1_MCLOCK_N, sCAM1_MCLOCK_P, sCSI0_MCLOCK_N, sCSI0_MCLOCK_P

### Notes on the sheet
- CAMERA 0 is always connected to HIGH speed header.
  CAMERA 1 is default connected to the LOW speed header.  To connect it to the HIGH speed header, change the resistors to disconnect it from I2C1 and connect it to I2C3.
- (near R14) ViSOR
- 7798-20-0228
- 2.0.0
- Brandon P Dixon
- (in symbol Res3) DNP

### Library data of the parts
R12-R17 = Res3: 0Ω Resistor; Published: 8-Jun-2000; LatestRevisionDate: 29-May-2009; LatestRevisionNote: IPC-7351 Footprint Added.; PackageReference: J1-0603; Publisher: Altium Limited; PackageDescription: Chip Resistor

## Sheet _power.SchDoc
size Tabloid
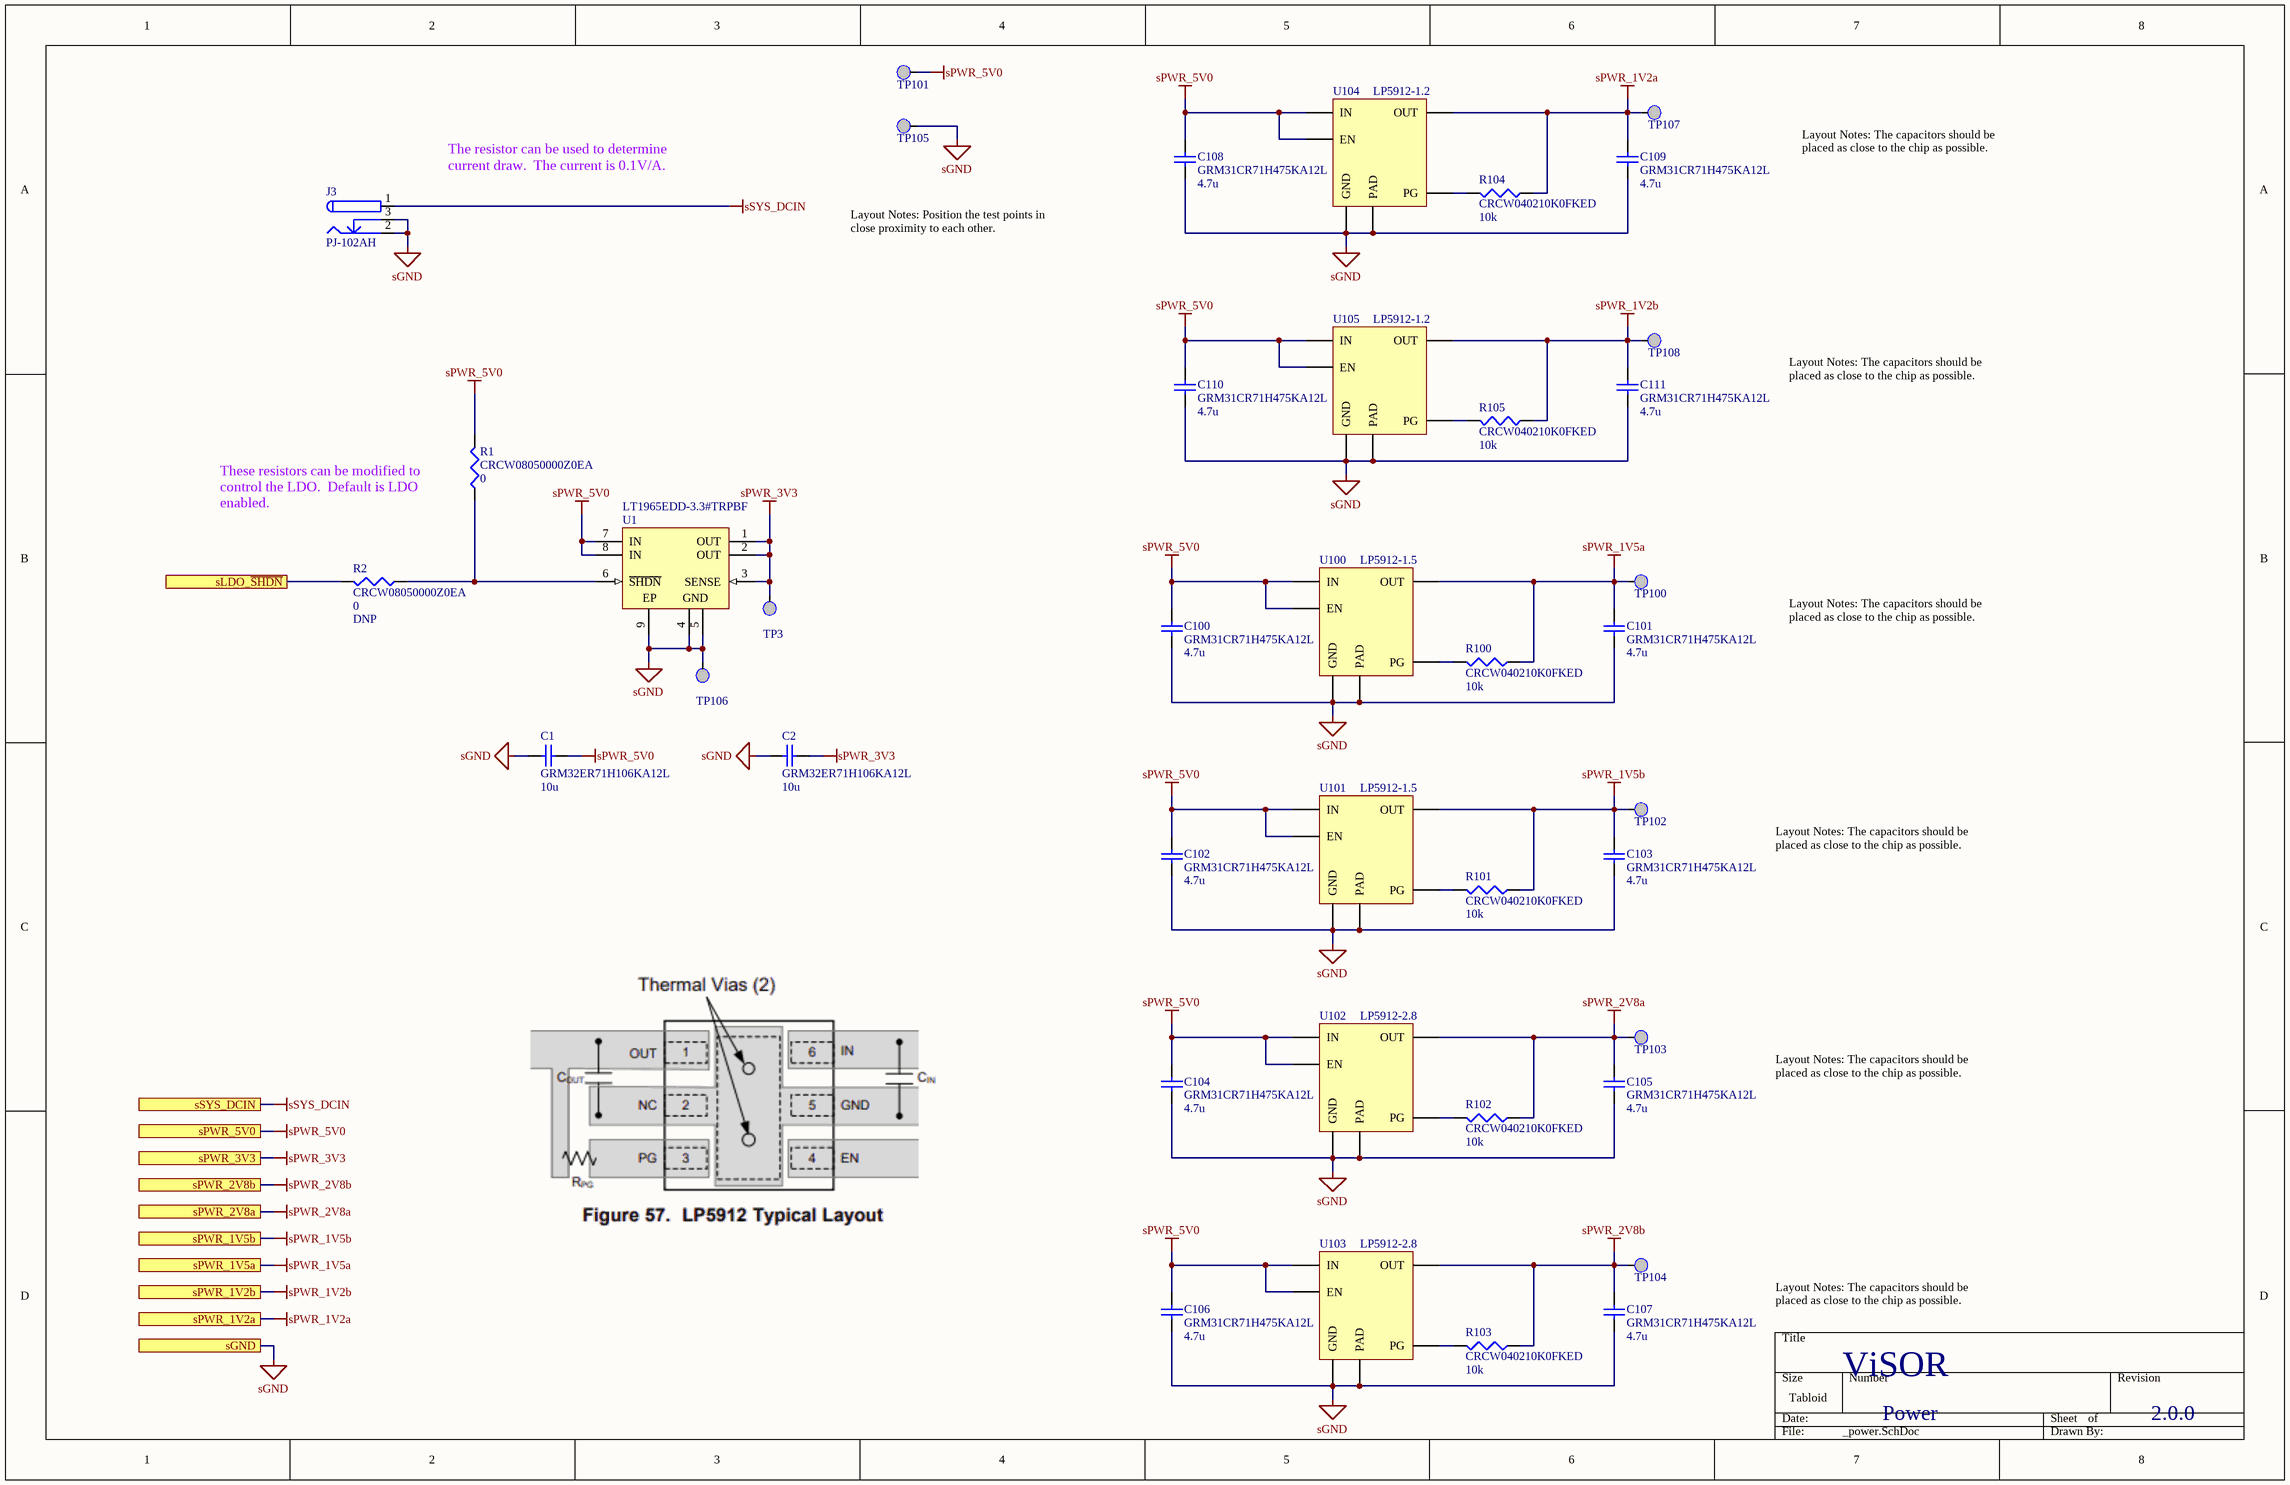
[diagram p4: _power.SchDoc]

### Parts
C1  GRM32ER71H106KA12L  value 10u  [1210]
C2  GRM32ER71H106KA12L  value 10u  [1210]
C100  GRM31CR71H475KA12L  value 4.7u  [1206]
C101  GRM31CR71H475KA12L  value 4.7u  [1206]
C102  GRM31CR71H475KA12L  value 4.7u  [1206]
C103  GRM31CR71H475KA12L  value 4.7u  [1206]
C104  GRM31CR71H475KA12L  value 4.7u  [1206]
C105  GRM31CR71H475KA12L  value 4.7u  [1206]
C106  GRM31CR71H475KA12L  value 4.7u  [1206]
C107  GRM31CR71H475KA12L  value 4.7u  [1206]
C108  GRM31CR71H475KA12L  value 4.7u  [1206]
C109  GRM31CR71H475KA12L  value 4.7u  [1206]
C110  GRM31CR71H475KA12L  value 4.7u  [1206]
C111  GRM31CR71H475KA12L  value 4.7u  [1206]
J3  PJ-102AH  [PJ-102AH]
R1  CRCW08050000Z0EA  value 0  [6-0805_M]
R2  CRCW08050000Z0EA  value 0  [6-0805_M]
R100  CRCW040210K0FKED  value 10k  [0402]
R101  CRCW040210K0FKED  value 10k  [0402]
R102  CRCW040210K0FKED  value 10k  [0402]
R103  CRCW040210K0FKED  value 10k  [0402]
R104  CRCW040210K0FKED  value 10k  [0402]
R105  CRCW040210K0FKED  value 10k  [0402]
TP3  TP  [TP_TH]  (value not drawn)
TP100  TP  [TP_TH]  (value not drawn)
TP101  TP  [TP_TH]  (value not drawn)
TP102  TP  [TP_TH]  (value not drawn)
TP103  TP  [TP_TH]  (value not drawn)
TP104  TP  [TP_TH]  (value not drawn)
TP105  TP  [TP_TH]  (value not drawn)
TP106  TP  [TP_TH]  (value not drawn)
TP107  TP  [TP_TH]  (value not drawn)
TP108  TP  [TP_TH]  (value not drawn)
U1  LT1965EDD-3.3#TRPBF  [LT-DD-8_V - MOD]
U100  LP5912-1.5  [DRV0006A]
U101  LP5912-1.5  [DRV0006A]
U102  LP5912-2.8  [DRV0006A]
U103  LP5912-2.8  [DRV0006A]
U104  LP5912-1.2  [DRV0006A]
U105  LP5912-1.2  [DRV0006A]

### Ports
sGND, sLDO_~{SHDN}, sPWR_1V2a, sPWR_1V2b, sPWR_1V5a, sPWR_1V5b, sPWR_2V8a, sPWR_2V8b, sPWR_3V3, sPWR_5V0, sSYS_DCIN

### Nets
sGND: C1.1 C2.1 C100.1 C101.1 C102.1 C103.1 C104.1 C105.1 C106.1 C107.1 C108.1 C109.1 C110.1 C111.1 J3.2 J3.3 TP105.1 TP106.1 U1.4(GND) U1.5(GND) U1.9(EP) U100.5(GND) U100.7(PAD) U101.5(GND) U101.7(PAD) U102.5(GND) U102.7(PAD) U103.5(GND) U103.7(PAD) U104.5(GND) U104.7(PAD) U105.5(GND) U105.7(PAD) ; port sGND  [project net sAG_GND]
sPWR_1V2a: C109.2 R104.1 TP107.1 U104.1(OUT) ; port sPWR_1V2a
sPWR_1V2b: C111.2 R105.1 TP108.1 U105.1(OUT) ; port sPWR_1V2b
sPWR_1V5a: C101.2 R100.1 TP100.1 U100.1(OUT) ; port sPWR_1V5a
sPWR_1V5b: C103.2 R101.1 TP102.1 U101.1(OUT) ; port sPWR_1V5b
sPWR_2V8a: C105.2 R102.1 TP103.1 U102.1(OUT) ; port sPWR_2V8a
sPWR_2V8b: C107.2 R103.1 TP104.1 U103.1(OUT) ; port sPWR_2V8b
sPWR_3V3: C2.2 TP3.1 U1.1(OUT) U1.2(OUT) U1.3(SENSE) ; port sPWR_3V3  [project net sAG_3V3]
sPWR_5V0: C1.2 C100.2 C102.2 C104.2 C106.2 C108.2 C110.2 R1.2 TP101.1 U1.7(IN) U1.8(IN) U100.4(EN) U100.6(IN) U101.4(EN) U101.6(IN) U102.4(EN) U102.6(IN) U103.4(EN) U103.6(IN) U104.4(EN) U104.6(IN) U105.4(EN) U105.6(IN) ; port sPWR_5V0
sSYS_DCIN: J3.1 ; port sSYS_DCIN
sGPIO_36/sLDO_~{SHDN}: R2.2 ; port sLDO_~{SHDN}
NetR1_1: R1.1 R2.1 U1.6(~{SHDN})
NetR100_2: R100.2 U100.3(PG)
NetR101_2: R101.2 U101.3(PG)
NetR102_2: R102.2 U102.3(PG)
NetR103_2: R103.2 U103.3(PG)
NetR104_2: R104.2 U104.3(PG)
NetR105_2: R105.2 U105.3(PG)

### Notes on the sheet
- Layout Notes: The capacitors should be placed as close to the chip as possible.
- The resistor can be used to determine current draw.  The current is 0.1V/A.
- Layout Notes: Position the test points in close proximity to each other.
- (near R1) These resistors can be modified to control the LDO.  Default is LDO enabled.
- ViSOR
- Power
- 2.0.0
- (in symbol Res3) DNP

### Library data of the parts
C1 C2 = GRM32ER71HxxxKdddd: -55-125C, 1005, 50V, X7R, ±10%
C100-C111 = GRM31CR71HxxxKdddd: -55-125C, 3216, 50V, X7R, ±10%
J3 = PJ-102AH: Low Voltage Power Supply Connector, 2.1 mm; Supplier 1: Mouser; Supplier Part Number 1: 490-PJ-102AH
R1 R2 = Res3: 0Ω Resistor; Published: 8-Jun-2000; LatestRevisionDate: 29-May-2009; LatestRevisionNote: IPC-7351 Footprint Added.; PackageReference: J1-0603; Publisher: Altium Limited; PackageDescription: Chip Resistor
R100-R105 = CRCW0402xxxxFKED: 0.125W, -55-155C, 1005, 50V, ±1%
U1 = LT1965EDD-3.3#TRPBF: 1.1 A, Low Noise, Low Dropout Linear Regulator, 1.8 to 20 V Vin, 3.3 V Vout, 8-pin SON (DD-8), -40 to 125 degC, Pb-Free, Tape and Reel; Manufacturer: Linear Technology; Discrete Pass Element: no; Dropout Voltage(V): 0.31; Iout(mA): 1100; Isupply(mA): 0.5; Noise(uV): 40; Number of Outputs: 1; Output Voltage: 3.3 V; PSRR(dB): 75; Vin Max(V): 20; Vin Min(V): 1.8; DatasheetVersion: Rev. A; PackageVersion: Jun-10; PackageReference: DD-8; PackageDescription: 8-Pin Plastic DFN, Body 3 x 3 mm, Pitch 0.5 mm; Supplier 1: Digi-Key; Supplier Part Number 1: LT1965EDD-3.3#TRPBF-ND; Packing: Tape and Reel; RoHS: TRUE; Shutdown Current(uA): 1; Mounting Technology: Surface Mount; Code_JEDEC: MO-229; PartNumber: LT1965EDD-3.3#TRPBF; ComponentLink1Description: Manufacturer URL; ComponentLink1URL: http://www.linear.com/; ComponentLink2Description: Datasheet; ComponentLink2URL: http://cds.linear.com/docs/en/datasheet/1965fa.pdf; ComponentLink3Description: Package Specification; ComponentLink3URL: http://cds.linear.com/docs/en/packaging/DFN_8_05-08-1698.pdf
U100-U105 = LP5912-x.x: 500-mA Low-Noise, Low-IQ LDO

## Sheet _io.SchDoc
size Tabloid
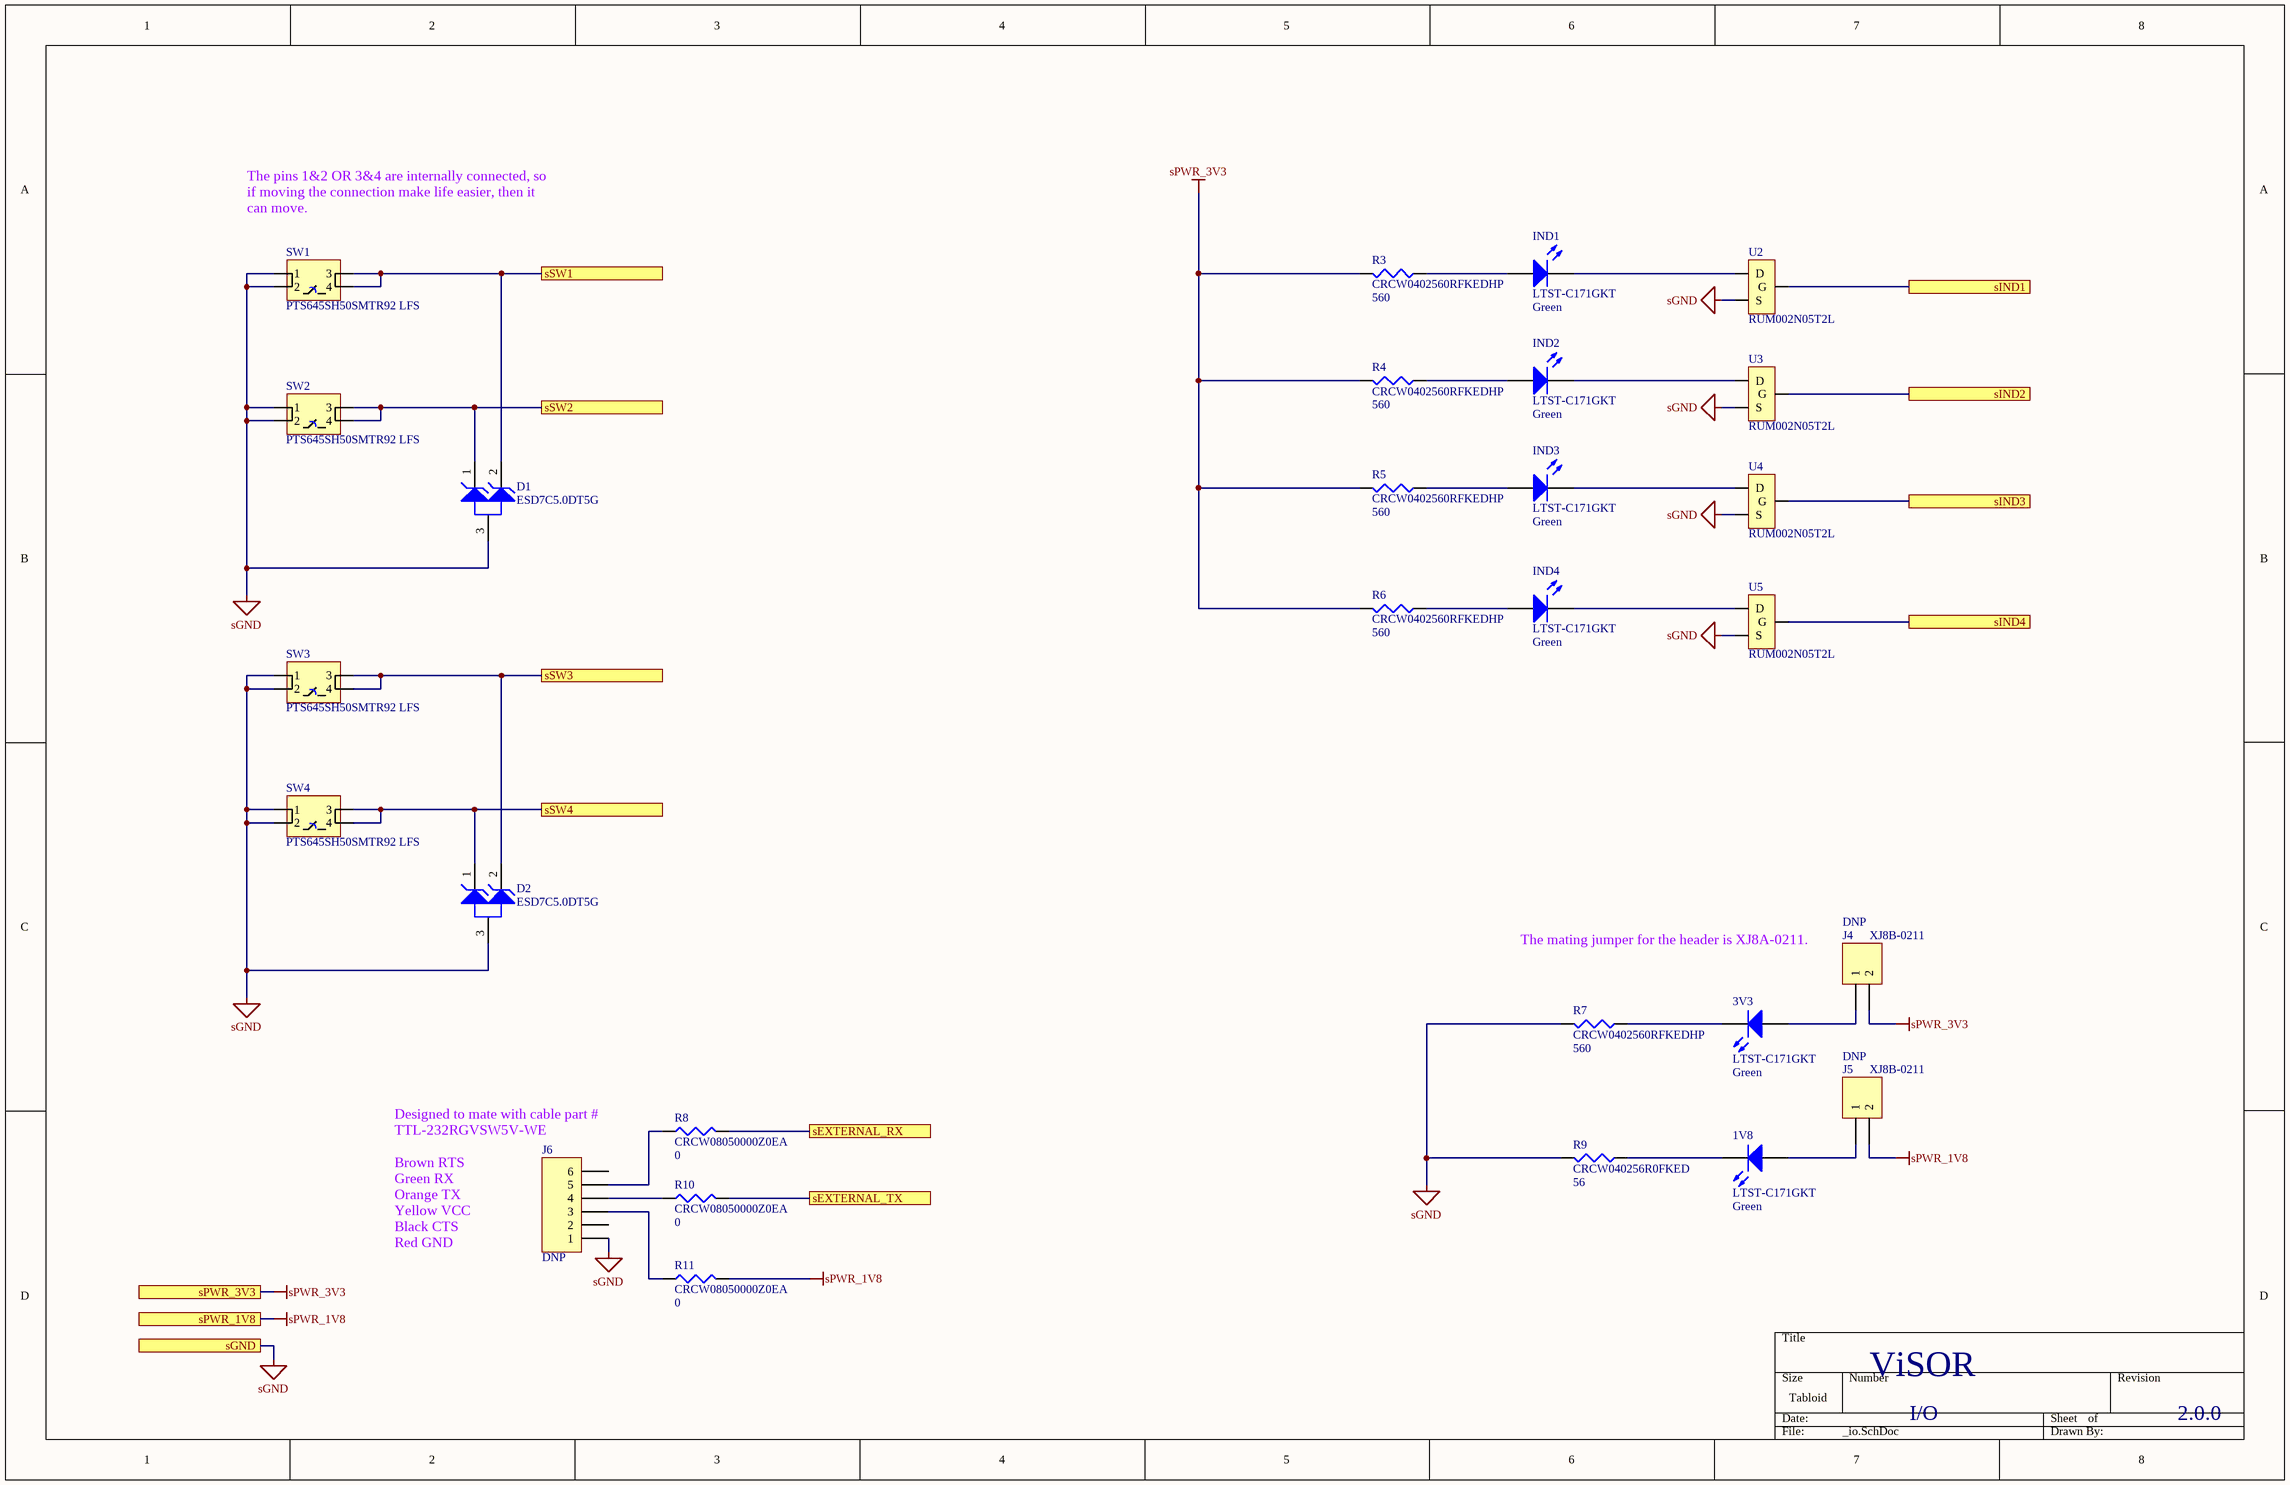
[diagram p5: _io.SchDoc]

### Parts
1V8  LTST-C171GKT  Color: Green  [0805]
3V3  LTST-C171GKT  Color: Green  [0805]
D1  ESD7C5.0DT5G  [ONSC-SOT-723-3-631AA-01_V]
D2  ESD7C5.0DT5G  [ONSC-SOT-723-3-631AA-01_V]
IND1  LTST-C171GKT  Color: Green  [0805]
IND2  LTST-C171GKT  Color: Green  [0805]
IND3  LTST-C171GKT  Color: Green  [0805]
IND4  LTST-C171GKT  Color: Green  [0805]
J4  XJ8B-0211  [HDR1X2]
J5  XJ8B-0211  [HDR1X2]
J6  DNP  [HDR1X6]
R3  CRCW0402560RFKEDHP  value 560  [0402]
R4  CRCW0402560RFKEDHP  value 560  [0402]
R5  CRCW0402560RFKEDHP  value 560  [0402]
R6  CRCW0402560RFKEDHP  value 560  [0402]
R7  CRCW0402560RFKEDHP  value 560  [0402]
R8  CRCW08050000Z0EA  value 0  [6-0805_M]
R9  CRCW040256R0FKED  value 56  [0402]
R10  CRCW08050000Z0EA  value 0  [6-0805_M]
R11  CRCW08050000Z0EA  value 0  [6-0805_M]
SW1  PTS645SH50SMTR92 LFS  [PTS645SH50SMTR92 LFS]
SW2  PTS645SH50SMTR92 LFS  [PTS645SH50SMTR92 LFS]
SW3  PTS645SH50SMTR92 LFS  [PTS645SH50SMTR92 LFS]
SW4  PTS645SH50SMTR92 LFS  [PTS645SH50SMTR92 LFS]
U2  RUM002N05T2L  [RUM002N05T2L]
U3  RUM002N05T2L  [RUM002N05T2L]
U4  RUM002N05T2L  [RUM002N05T2L]
U5  RUM002N05T2L  [RUM002N05T2L]

### Ports
sEXTERNAL_RX, sEXTERNAL_TX, sGND, sIND1, sIND2, sIND3, sIND4, sPWR_1V8, sPWR_3V3, sSW1, sSW2, sSW3, sSW4

### Nets
sGND: D1.3(A) D2.3(A) J6.1 R7.2 R9.2 SW1.1 SW1.2 SW2.1 SW2.2 SW3.1 SW3.2 SW4.1 SW4.2 U2.2(S) U3.2(S) U4.2(S) U5.2(S) ; port sGND  [project net sAG_GND]
sPWR_1V8: J5.2 R11.2 ; port sPWR_1V8  [project net sAG_1V8]
sPWR_3V3: J4.2 R3.2 R4.2 R5.2 R6.2 ; port sPWR_3V3  [project net sAG_3V3]
sGPIO_0/sIND2: U3.1(G) ; port sIND2
sGPIO_1/sSW2: D1.1(K1) SW2.3 SW2.4 ; port sSW2
sGPIO_2/sIND1: U2.1(G) ; port sIND1
sGPIO_3/sSW4: D2.1(K1) SW4.3 SW4.4 ; port sSW4
sGPIO_12/sSW1: D1.2(K2) SW1.3 SW1.4 ; port sSW1
sGPIO_24/sIND4: U5.1(G) ; port sIND4
sGPIO_115/sIND3: U4.1(G) ; port sIND3
sMPP_4/sSW3: D2.2(K2) SW3.3 SW3.4 ; port sSW3
sUART1_RX/sEXTERNAL_TX: R10.2 ; port sEXTERNAL_TX
sUART1_TX/sEXTERNAL_RX: R8.2 ; port sEXTERNAL_RX
Net1V8_1: 1V8.1(A) J5.1
Net1V8_2: 1V8.2(K) R9.1
Net3V3_1: 3V3.1(A) J4.1
Net3V3_2: 3V3.2(K) R7.1
NetIND1_1: IND1.1(A) R3.1
NetIND1_2: IND1.2(K) U2.3(D)
NetIND2_1: IND2.1(A) R4.1
NetIND2_2: IND2.2(K) U3.3(D)
NetIND3_1: IND3.1(A) R5.1
NetIND3_2: IND3.2(K) U4.3(D)
NetIND4_1: IND4.1(A) R6.1
NetIND4_2: IND4.2(K) U5.3(D)
NetJ6_3: J6.3 R11.1
NetJ6_4: J6.4 R10.1
NetJ6_5: J6.5 R8.1

Not connected (* = marked no-connect by the designer): J6 2 6

### Notes on the sheet
- The pins 1&2 OR 3&4 are internally connected, so if moving the connection make life easier, then it can move.
- (near J4) The mating jumper for the header is XJ8A-0211.
- (near J6) Designed to mate with cable part # TTL-232RGVSW5V-WE
  Brown	RTS
  Green	RX
  Orange	TX
  Yellow	VCC
  Black	CTS
  Red	GND
- ViSOR
- I/O
- 2.0.0

### Library data of the parts
1V8 3V3 IND1-IND4 = LTST-C171GKT: LED
D1 D2 = CMP-1063-00208-1: Transient Voltage Suppressor, Micro-Packaged Diode for ESD Protection, 3-Pin SOT-723, Pb-Free, Tape and Reel; Manufacturer: On Semiconductor; C Max (pF): 6.2; Direction: Unidirectional; IR Max (uA): 0.5; V(BR) Min (V): 11; Number of Lines: 2; VRWM Max (V): 5; ComponentLink2Description: Datasheet; PackageVersion: Rev. D, 08/2009; PackageDescription: 3-Pin Small Outline Transistor, Body 1.2 x 0.8 mm, Pitch 0.4 mm; ComponentLink1URL: http://www.onsemi.com/; ComponentLink1Description: Manufacturer URL; RoHS: Pb-Free; DatasheetVersion: Rev. 3; Mounting Technology: Surface Mount; ComponentLink3URL: http://www.onsemi.com/pub_link/Collateral/631AA.PDF; Packing: Tape and Reel; ComponentLink2URL: http://www.onsemi.cn/pub_link/Collateral/ESD7C3.3D-D.PDF; PackageReference: SOT-723-3-631AA-01; ComponentLink3Description: Package Specification; PartNumber: ESD7C5.0DT5G
J4 J5 = Header 2: Header, 2-Pin; LatestRevisionDate: 17-Jul-2002; LatestRevisionNote: Re-released for DXP Platform.; Publisher: Altium Limited; DNP: DNP
J6 = Header 6: Header, 6-Pin; LatestRevisionDate: 17-Jul-2002; LatestRevisionNote: Re-released for DXP Platform.; Publisher: Altium Limited
R3-R7 R9 = CRCW0402xxxxFKED: 0.125W, -55-155C, 1005, 50V, ±1%
R8 R10 R11 = Res3: 0Ω Resistor; Published: 8-Jun-2000; LatestRevisionDate: 29-May-2009; LatestRevisionNote: IPC-7351 Footprint Added.; PackageReference: J1-0603; Publisher: Altium Limited; PackageDescription: Chip Resistor
SW1-SW4 = PTS645SH50SMTR92 LFS: Tactile Switch
U2-U5 = RUM002N05T2L: MOSFET N-CH 50V 0.2A 3VMT

## Nets that join several sheets
sAG_1V8: _i2c0 (R200.2 R201.2), Accelerometer and Mangnetometer (5 pins), Gyroscope (C351_Gyroscope.2 R350_Gyroscope.1 U350_Gyroscope.18)
sAG_1V8: _io (J5.2 R11.2), Accelerometer & Magnetometer (5 pins), Gyroscope (C351.2 R350.1 U350.18)
sAG_3V3: Accelerometer and Mangnetometer (C303_Accelerometer_and_Mangnetometer.2 C304_Accelerometer_and_Mangnetometer.2 U300_Accelerometer_and_Mangnetometer.14), Gyroscope (C352_Gyroscope.2 C353_Gyroscope.1 U350_Gyroscope.15 U350_Gyroscope.17)
sAG_3V3: _power (5 pins), _io (5 pins), Accelerometer & Magnetometer (C303.2 C304.2 U300.14), Gyroscope (C352.2 C353.1 U350.15 U350.17)
sAG_GND: Accelerometer and Mangnetometer (11 pins), Gyroscope (19 pins)
sAG_GND: _power (33 pins), _io (17 pins), Accelerometer & Magnetometer (11 pins), Gyroscope (19 pins)
sI2C0_SCL: _i2c0 (R200.1), Accelerometer and Mangnetometer (U300_Accelerometer_and_Mangnetometer.4), Gyroscope (U350_Gyroscope.11)
sI2C0_SCL: Accelerometer & Magnetometer (U300.4), Gyroscope (U350.11)
sI2C0_SDA: _i2c0 (R201.1), Accelerometer and Mangnetometer (U300_Accelerometer_and_Mangnetometer.6), Gyroscope (U350_Gyroscope.12)
sI2C0_SDA: Accelerometer & Magnetometer (U300.6), Gyroscope (U350.12)